# EAGLE design DualAttenuverter (EAGLE 9.6.0)
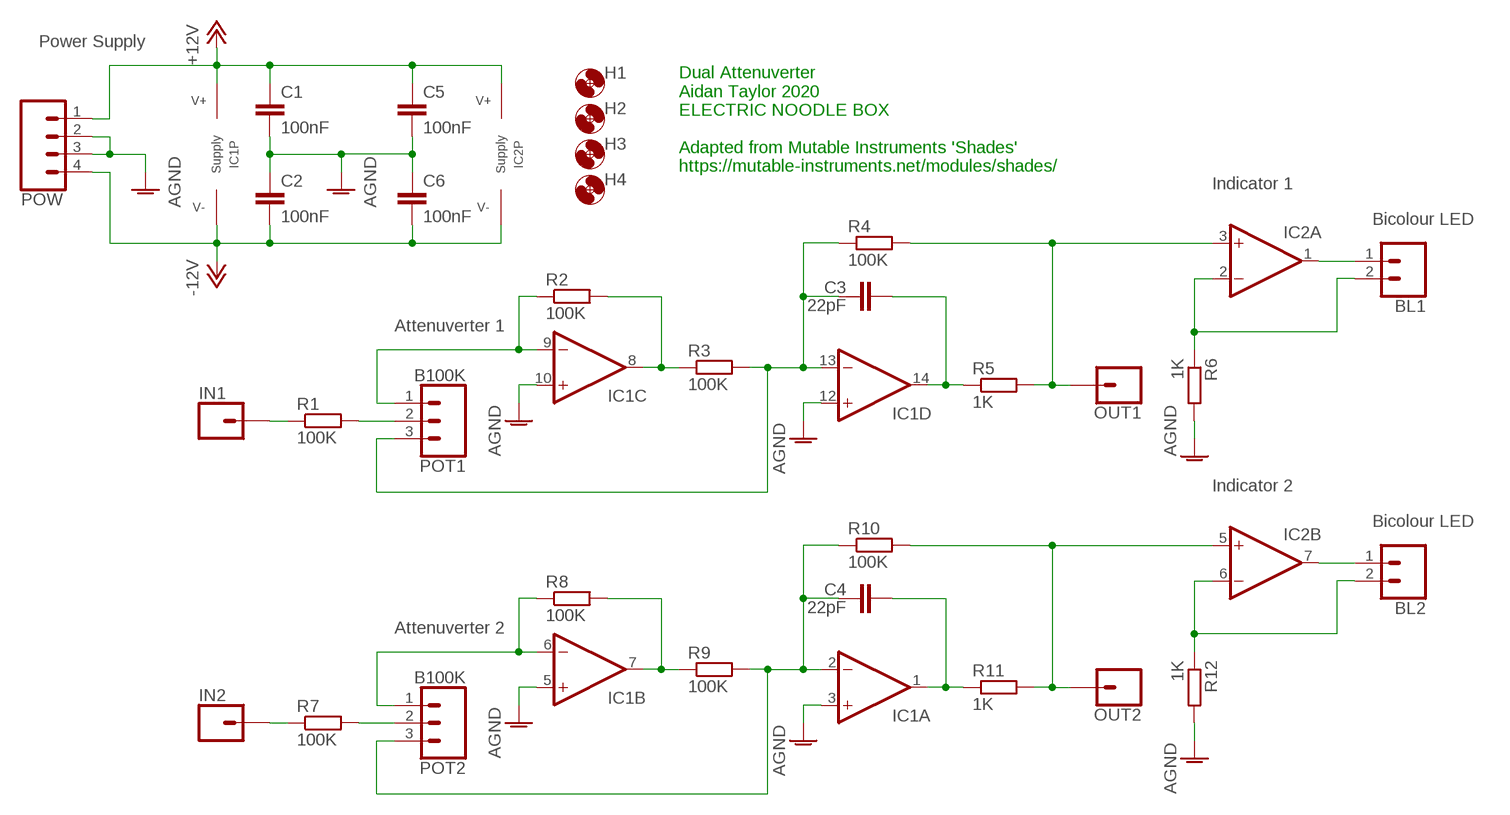
[diagram p0: schematic, sheet 1]

## Parts
BL1  2XWIREPAD  [1X02]
BL2  2XWIREPAD  [1X02]
C1  100nF  C-EU050-025X075  [C050-025X075]
C2  100nF  C-EU050-025X075  [C050-025X075]
C3  22pF  C-EU050-025X075  [C050-025X075]
C4  22pF  C-EU050-025X075  [C050-025X075]
C5  100nF  C-EU050-025X075  [C050-025X075]
C6  100nF  C-EU050-025X075  [C050-025X075]
H1  MOUNT-HOLE3.2  [3,2]
H2  MOUNT-HOLE3.2  [3,2]
H3  MOUNT-HOLE3.2  [3,2]
H4  MOUNT-HOLE3.2  [3,2]
IC1  TL0X4DIL  [DIL14]
IC2  LM358  [DIL08]
IN1  1XWIREPAD  [1X01]
IN2  1XWIREPAD  [1X01]
OUT1  1XWIREPAD  [1X01]
OUT2  1XWIREPAD  [1X01]
POT1  B100K  3XWIREPAD  [1X03]
POT2  B100K  3XWIREPAD  [1X03]
POW  4XMOLEX  [MOLEX-1X4]
R1  100K  R-EU_0207/10  [0207/10]
R2  100K  R-EU_0207/10  [0207/10]
R3  100K  R-EU_0207/10  [0207/10]
R4  100K  R-EU_0207/10  [0207/10]
R5  1K  R-EU_0207/10  [0207/10]
R6  1K  R-EU_0207/10  [0207/10]
R7  100K  R-EU_0207/10  [0207/10]
R8  100K  R-EU_0207/10  [0207/10]
R9  100K  R-EU_0207/10  [0207/10]
R10  100K  R-EU_0207/10  [0207/10]
R11  1K  R-EU_0207/10  [0207/10]
R12  1K  R-EU_0207/10  [0207/10]

## Nets
+12V: C1.1 C5.1 IC1.4(P:V+) IC2.8(P:V+) POW.1
-12V: C2.2 C6.2 IC1.11(P:V-) IC2.4(P:V-) POW.4
AGND: C1.2 C2.1 C5.2 C6.1 IC1.3(A:+IN) IC1.5(B:+IN) IC1.10(C:+IN) IC1.12(D:+IN) POW.2 POW.3 R6.2 R12.2
N$1: POT1.2 R1.2
N$2: IC1.9(C:-IN) POT1.1 R2.1
N$3: POT2.2 R7.2
N$4: IC1.8(C:OUT) R2.2 R3.1
N$5: C3.1 IC1.13(D:-IN) POT1.3 R3.2 R4.1
N$6: IC2.3(A:+IN) OUT1.1 R4.2 R5.2
N$7: C3.2 IC1.14(D:OUT) R5.1
N$8: BL1.1 IC2.1(A:OUT)
N$9: IN1.1 R1.1
N$11: IC1.6(B:-IN) POT2.1 R8.1
N$12: IC1.7(B:OUT) R8.2 R9.1
N$13: C4.1 IC1.2(A:-IN) POT2.3 R9.2 R10.1
N$14: IC2.5(B:+IN) OUT2.1 R10.2 R11.2
N$15: C4.2 IC1.1(A:OUT) R11.1
N$16: IN2.1 R7.1
N$17: BL2.1 IC2.7(B:OUT)
N$18: BL2.2 IC2.6(B:-IN) R12.1
N$19: BL1.2 IC2.2(A:-IN) R6.1

## Notes on the sheet
- Power Supply
- Dual Attenuverter
  Aidan Taylor 2020
  ELECTRIC NOODLE BOX
  
  Adapted from Mutable Instruments 'Shades'
  https://mutable-instruments.net/modules/shades/
- Indicator 1
- Bicolour LED
- Attenuverter 1
- Indicator 2
- Bicolour LED
- Attenuverter 2

## Library data of the parts
BL1 BL2 = ElectricNoodleBox:2XWIREPAD
C1-C6 = rcl:C-EU: CAPACITOR, European symbol; SPICEPREFIX: C
H1-H4 = holes:MOUNT-HOLE: MOUNTING HOLE with drill center marker
IC1 = ElectricNoodleBox:TL0X4
IC2 = ElectricNoodleBox:LM358
IN1 IN2 OUT1 OUT2 = ElectricNoodleBox:1XWIREPAD
POT1 POT2 = ElectricNoodleBox:3XWIREPAD
POW = ElectricNoodleBox:4XMOLEX
R1-R12 = rcl:R-EU_: RESISTOR, European symbol; SPICEPREFIX: R

## Board
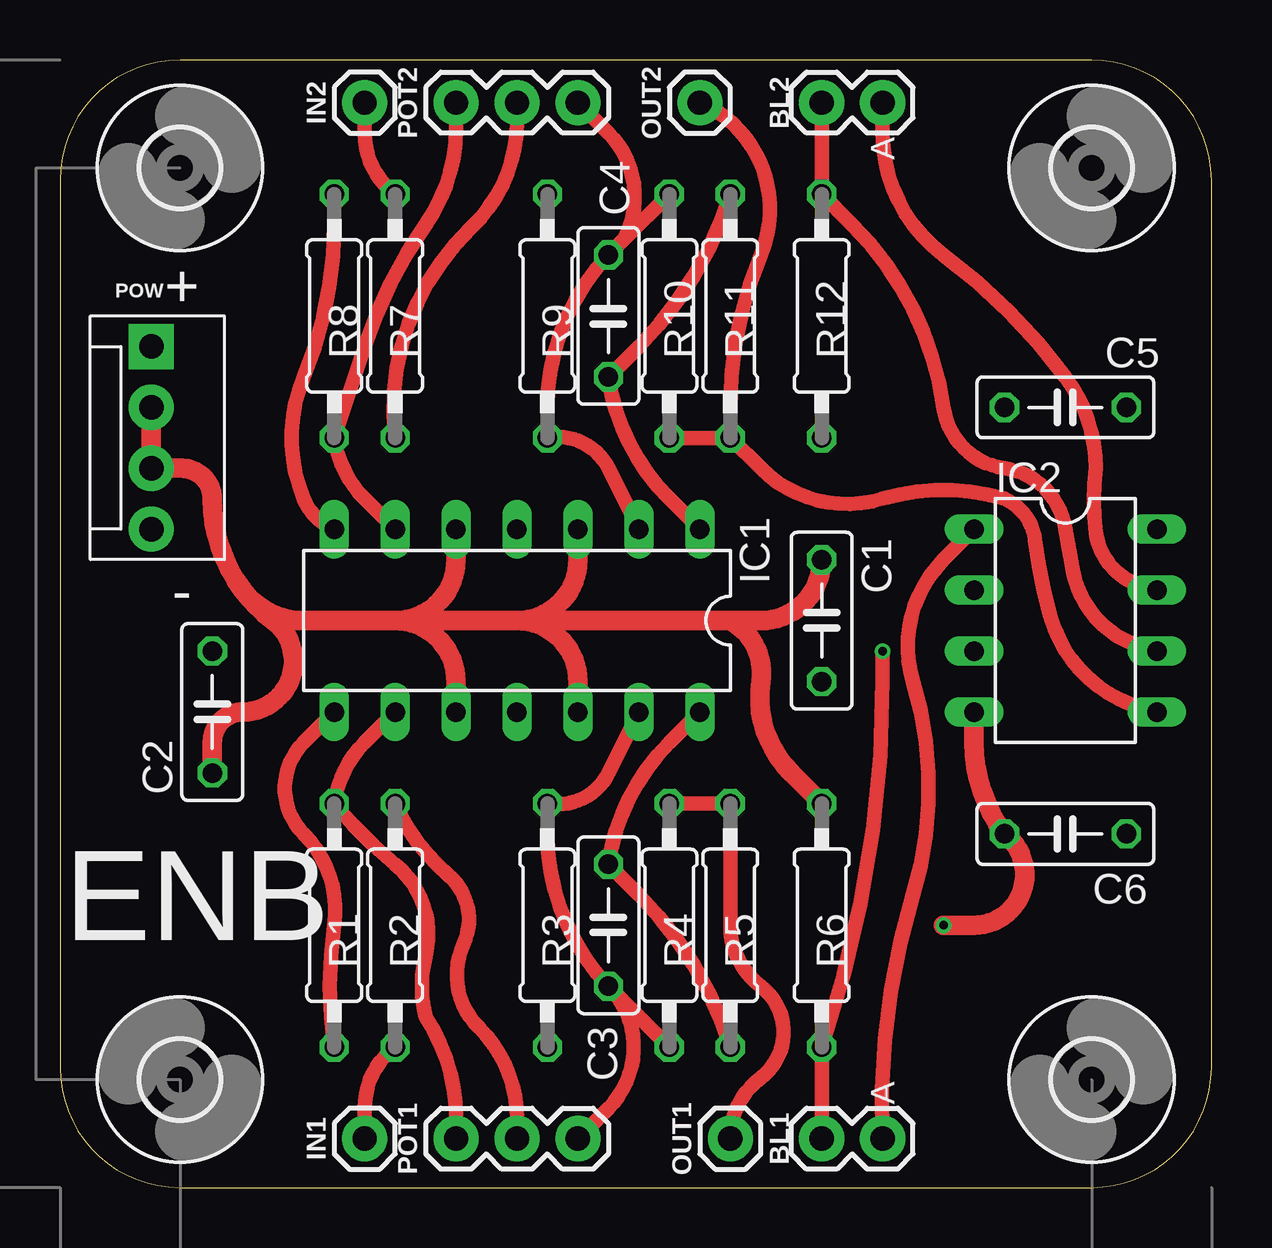
[diagram p1: board, top side]
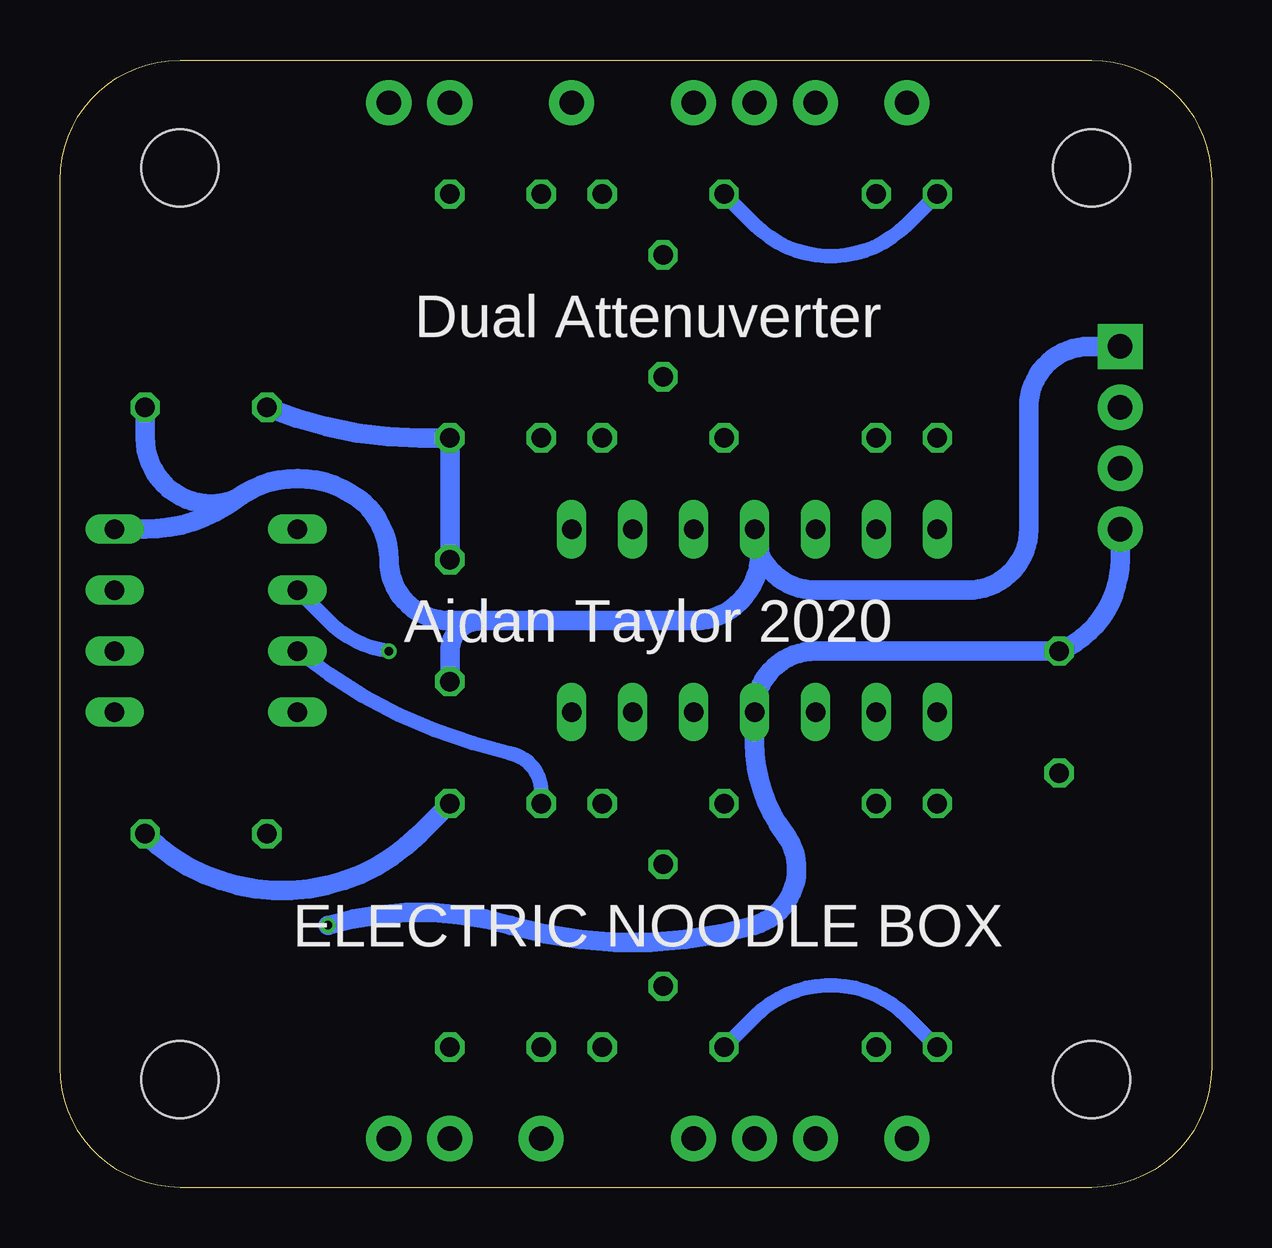
[diagram p2: board, bottom side, seen from below]

Size 48 x 47 mm. Coordinates in mm from the lower left corner, seen from the top.
Outline: 0,42 0,5 arc90 5,0 43,0 arc90 48,5 48,42 arc90 43,47 5,47 arc90 0,42
Copper layers (1*16): Top 0.035mm / dielectric 1.6mm / Bottom 0.035mm
Design rules "Elecrow_2-layer_PCB_eagle_rule": minimum track width 6mil, minimum drill 12mil, track to track 6mil, track to pad 6mil, pad to pad 6mil, via to via 8mil, smd to smd 0mil, copper to edge 20mil, drill to drill 10mil, minimum pad ring 6mil, minimum via ring 6mil, stop-mask expansion 0mil, vias tented up to drill 100mil, thermal gap 10mil

### Footprints (pad centres in the part's own frame; a part is rotated, then mirrored left to right if it is on the bottom)
1X02 = drill 1.016 pad 1.88: 1 0,0; 2 2.54,0
C050-025X075 = drill 0.813 octagon: 1 -2.54,0; 2 2.54,0
3,2 = hole 3.2: 0,0
DIL14 = drill 0.813 long: 1 -7.62,-3.81; 2 -5.08,-3.81; 3 -2.54,-3.81; 4 0,-3.81; 5 2.54,-3.81; 6 5.08,-3.81; 7 7.62,-3.81; 8 7.62,3.81; 9 5.08,3.81; 10 2.54,3.81; 11 0,3.81; 12 -2.54,3.81; 13 -5.08,3.81; 14 -7.62,3.81
DIL08 = drill 0.813 long: 1 -3.81,-3.81; 2 -1.27,-3.81; 3 1.27,-3.81; 4 3.81,-3.81; 5 3.81,3.81; 6 1.27,3.81; 7 -1.27,3.81; 8 -3.81,3.81
1X01 = drill 1.016 pad 1.88: 1 0,0
1X03 = drill 1.016 pad 1.88: 1 0,0; 2 2.54,0; 3 5.08,0
MOLEX-1X4 = drill 1.016 pad 1.88 square: 1 0,0 | drill 1.016 pad 1.88: 2 2.54,0; 3 5.08,0; 4 7.62,0
0207/10 = drill 0.813 octagon: 1 -5.08,0; 2 5.08,0

### Placement (x,y rotation side)
BL1  34.29,2.04 180 top
BL2  34.29,45.22 180 top
C1  31.75,23.63 90 top
C2  6.35,19.82 90 top
C3  22.86,10.93 90 top
C4  22.86,36.33 270 top
C5  41.91,32.52 180 top
C6  41.91,14.74 180 top
H1  5,4.5 90 top
H2  5,42.5 0 top
H3  43,4.5 0 top
H4  43,42.5 0 top
IC1  19.05,23.63 180 top
IC2  41.91,23.63 270 top
IN1  12.7,2.04 0 top
IN2  12.7,45.22 0 top
OUT1  27.94,2.04 0 top
OUT2  26.67,45.22 0 top
POT1  16.51,2.04 0 top
POT2  16.51,45.22 0 top
POW  3.81,35.06 270 top
R1  13.97,10.93 90 top
R2  11.43,10.93 270 top
R3  20.32,10.93 90 top
R4  25.4,10.93 90 top
R5  27.94,10.93 90 top
R6  31.75,10.93 90 top
R7  13.97,36.33 270 top
R8  11.43,36.33 90 top
R9  20.32,36.33 270 top
R10  25.4,36.33 270 top
R11  27.94,36.33 270 top
R12  31.75,36.33 270 top

### Tracks (layer width: path | path; a pad name or v marks a point on that pad's centre or on a via)
+12V
  Bottom 0.813: POW.1 5.08,35.06 arc-90 7.62,32.52 7.62,27.44 arc90 10.16,24.9 16.51,24.9 arc90 IC1.4 arc113 21.59,23.63 30.48,23.63 | C1.1 31.75,22.36 arc90 30.48,23.63 | 40.64,28.71 arc37 44.45,27.44 IC2.8 | 40.64,28.71 arc74 35.56,28.71 arc53 34.29,26.17 arc-90 31.75,23.63 30.48,23.63 | C5.1 44.45,31.25 arc-113 40.64,28.71
-12V  (via drill 0.35)
  Top 0.813: v36.83,10.93 38.1,10.93 arc143 C6.2 arc-37 38.1,18.55 IC2.4
  Bottom 0.813: POW.4 3.81,26.17 arc67 C2.2 16.51,22.36 arc-90 IC1.11 19.05,18.55 arc-37 17.78,14.74 arc111 19.05,10.93 arc33 29.21,10.93 arc-33 v36.83,10.93
AGND
  Top 0.813: POW.2 POW.3 5.08,29.98 arc-90 6.35,28.71 arc37 7.62,24.9 | 7.62,24.9 arc53 10.16,23.63 13.97,23.63 | 13.97,23.63 19.05,23.63 | 19.05,23.63 27.94,23.63 | 27.94,23.63 29.21,23.63 arc90 C1.2 | IC1.3 21.59,26.17 arc-90 19.05,23.63 | IC1.12 21.59,21.09 arc90 19.05,23.63 | IC1.5 16.51,26.17 arc-90 13.97,23.63 | IC1.10 16.51,21.09 arc90 13.97,23.63 | R6.2 30.48,17.28 arc-53 29.21,21.09 arc69 27.94,23.63 | C2.1 6.35,18.55 arc-90 7.62,19.82 arc143 8.89,23.63 arc-16 7.62,24.9
  Bottom 0.813: R6.2 33.02,14.74 arc90 C6.1 | C5.2 arc-23 33.02,31.25 R12.2 C1.2
N$1
  Top 0.61: POT1.2 19.05,2.86 arc45 17.46,6.67 arc-70 16.83,10.16 arc74 16.19,13.02 arc-26 R1.2
N$2
  Top 0.61: IC1.9 12.7,18.55 arc37 R2.1 arc12 13.97,13.47 arc-65 15.24,9.66 arc28 15.24,7.12 arc-33 16.51,2.86 POT1.1
N$3
  Top 0.61: POT2.2 19.05,44.45 arc-46 17.14,40.01 arc53 R7.2
N$4
  Top 0.61: R2.2 arc-16 11.43,10.93 arc53 10.16,14.74 arc-90 10.16,18.55 IC1.8
  Bottom 0.61: R2.2 12.7,7.12 arc-90 19.05,7.12 R3.1
N$5
  Top 0.61: C3.1 arc-44 20.32,14.74 R3.2 arc74 22.86,17.28 IC1.13 | C3.1 R4.1 | C3.1 arc-90 22.86,3.31 POT1.3
N$6
  Top 0.61: OUT1.1 arc-53 29.21,4.58 arc106 29.21,8.39 arc-53 27.94,10.93 R5.2 R4.2
  Bottom 0.61: R5.2 27.94,16.51 arc-77 29.21,18.1 arc26 IC2.3
N$7
  Top 0.61: IC1.14 25.4,18.55 arc37 C3.2 24.13,12.2 arc-28 R5.1
N$8
  Top 0.61: BL1.1 arc-20 35.56,12.2 arc34 35.56,21.09 arc-62 36.83,26.17 IC2.1
N$9
  Top 0.61: IN1.1 12.7,3.31 arc-53 R1.1
N$11
  Top 0.61: IC1.6 12.7,28.71 arc-37 R8.1 12.7,35.06 arc-16 15.24,40.14 arc35 16.51,44.13 POT2.1
N$12
  Top 0.61: R8.2 11.43,40.14 arc-23 10.16,33.79 arc45 10.16,28.71 arc45 IC1.7
  Bottom 0.61: R8.2 12.7,40.14 arc90 19.05,40.14 R9.1
N$13
  Top 0.61: IC1.2 22.86,29.98 arc74 R9.2 20.32,32.52 arc-44 C4.1 23.5,39.51 | 23.5,39.51 R10.1 | 23.5,39.51 arc74 22.86,43.95 POT2.3
N$14
  Top 0.61: R10.2 R11.2 | R11.2 27.94,32.52 arc-23 29.21,38.87 arc45 29.21,42.68 arc45 OUT2.1 | R11.2 29.21,29.98 arc62 34.29,28.71 arc-34 39.37,28.71 arc-60 40.64,26.99 arc9 41.27,23.81 arc58 45.09,20 IC2.5
N$15
  Top 0.61: IC1.1 25.4,28.71 arc-37 C4.2 24.13,35.06 arc28 R11.1
N$16
  Top 0.61: IN2.1 12.7,43.95 arc53 R7.1
N$17
  Top 0.61: BL2.1 34.29,43.95 arc53 36.83,38.87 arc-16 41.91,33.79 arc-37 43.18,29.98 arc14 43.18,27.3 arc67 45.09,25.08 IC2.7
N$18
  Top 0.61: BL2.2 R12.1 33.02,40.14 arc-37 36.83,32.52 arc74 39.37,29.98 arc-74 41.91,27.44 arc-1 42.23,25.72 arc64 45.09,22.54 IC2.6
N$19  (via drill 0.35)
  Top 0.61: BL1.2 R6.1 arc19 34.29,21.09 v34.29,22.36
  Bottom 0.61: v34.29,22.36 arc37 36.83,23.63 IC2.2

### Text on the board
tPlace: A | + | - | ENB | A
bPlace: Dual Attenuverter | Aidan Taylor 2020 | ELECTRIC NOODLE BOX